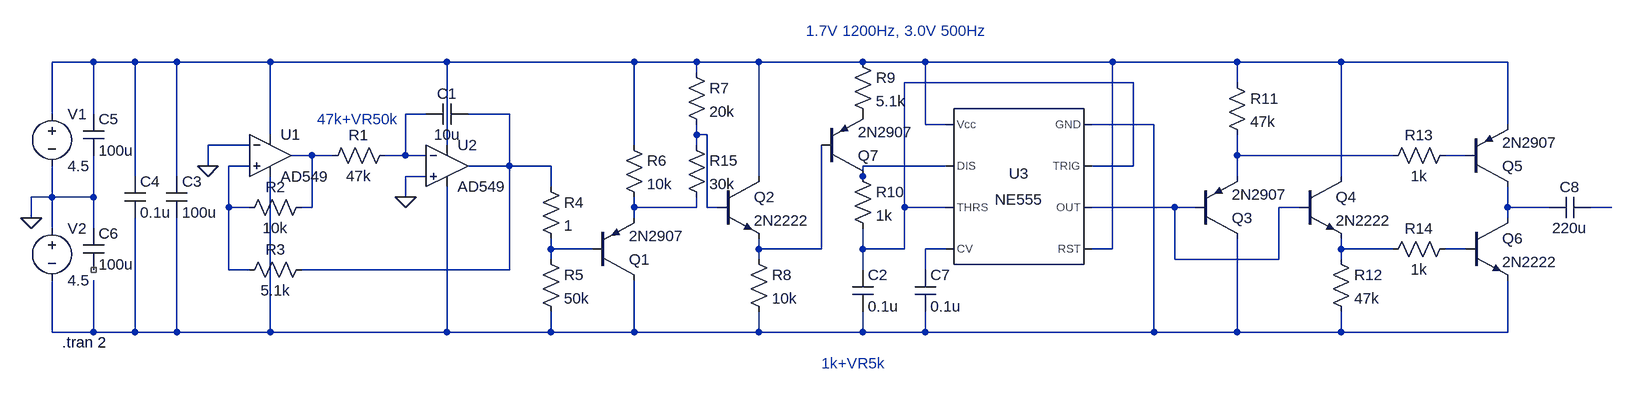
[diagram p0: schematic synthesizer2.asc]
synthesizer2.asc, the LTspice schematic file:
Version 4
SHEET 1 2196 696
WIRE -144 -32 -208 -32
WIRE -80 -32 -144 -32
WIRE -16 -32 -80 -32
WIRE 128 -32 -16 -32
WIRE 400 -32 128 -32
WIRE 688 -32 400 -32
WIRE 784 -32 688 -32
WIRE 880 -32 784 -32
WIRE 1040 -32 880 -32
WIRE 1136 -32 1040 -32
WIRE 1424 -32 1136 -32
WIRE 1616 -32 1424 -32
WIRE 1776 -32 1616 -32
WIRE 2032 -32 1776 -32
WIRE 784 -16 784 -32
WIRE 1456 0 1104 0
WIRE 1616 0 1616 -32
WIRE -208 48 -208 -32
WIRE -144 48 -144 -32
WIRE 368 48 336 48
WIRE 496 48 432 48
WIRE 1136 64 1136 -32
WIRE 1168 64 1136 64
WIRE 1488 64 1392 64
WIRE 2032 64 2032 -32
WIRE 128 80 128 -32
WIRE 784 80 784 64
WIRE 800 80 784 80
WIRE 96 96 32 96
WIRE 400 96 400 -32
WIRE 688 96 688 -32
WIRE 784 96 784 80
WIRE 192 112 160 112
WIRE 224 112 192 112
WIRE 336 112 336 48
WIRE 336 112 304 112
WIRE 368 112 336 112
WIRE 1616 112 1616 80
WIRE 1856 112 1616 112
WIRE 1968 112 1936 112
WIRE 32 128 32 96
WIRE 96 128 64 128
WIRE 496 128 496 48
WIRE 496 128 432 128
WIRE 560 128 496 128
WIRE 1168 128 1040 128
WIRE 1456 128 1456 0
WIRE 1456 128 1392 128
WIRE -80 144 -80 -32
WIRE -16 144 -16 -32
WIRE 368 144 336 144
WIRE 880 144 880 -32
WIRE 1040 144 1040 128
WIRE 1616 144 1616 112
WIRE 1776 144 1776 -32
WIRE 560 160 560 128
WIRE -208 176 -208 128
WIRE -208 176 -240 176
WIRE -144 176 -144 112
WIRE -144 176 -208 176
WIRE 336 176 336 144
WIRE 64 192 64 128
WIRE 96 192 64 192
WIRE 192 192 192 112
WIRE 192 192 176 192
WIRE 688 192 688 176
WIRE 784 192 784 176
WIRE 784 192 688 192
WIRE 800 192 800 80
WIRE 816 192 800 192
WIRE 1104 192 1104 0
WIRE 1168 192 1104 192
WIRE 1520 192 1392 192
WIRE 1552 192 1520 192
WIRE 1712 192 1680 192
WIRE 2032 192 2032 160
WIRE 2096 192 2032 192
WIRE 2192 192 2160 192
WIRE -240 208 -240 176
WIRE 688 208 688 192
WIRE 2032 208 2032 192
WIRE -208 224 -208 176
WIRE -144 224 -144 176
WIRE 560 256 560 240
WIRE 624 256 560 256
WIRE 880 256 880 240
WIRE 976 256 976 96
WIRE 976 256 880 256
WIRE 1040 256 1040 224
WIRE 1104 256 1104 192
WIRE 1104 256 1040 256
WIRE 1168 256 1136 256
WIRE 1424 256 1424 -32
WIRE 1424 256 1392 256
WIRE 1776 256 1776 240
WIRE 1856 256 1776 256
WIRE 1968 256 1936 256
WIRE 560 272 560 256
WIRE 880 272 880 256
WIRE 1520 272 1520 192
WIRE 1680 272 1680 192
WIRE 1680 272 1520 272
WIRE 1776 272 1776 256
WIRE 64 288 64 192
WIRE 96 288 64 288
WIRE 496 288 496 128
WIRE 496 288 176 288
WIRE 1040 288 1040 256
WIRE 1136 288 1136 256
WIRE -208 384 -208 304
WIRE -144 384 -144 304
WIRE -144 384 -208 384
WIRE -80 384 -80 208
WIRE -80 384 -144 384
WIRE -16 384 -16 208
WIRE -16 384 -80 384
WIRE 128 384 128 144
WIRE 128 384 -16 384
WIRE 400 384 400 160
WIRE 400 384 128 384
WIRE 560 384 560 352
WIRE 560 384 400 384
WIRE 688 384 688 304
WIRE 688 384 560 384
WIRE 880 384 880 352
WIRE 880 384 688 384
WIRE 1040 384 1040 352
WIRE 1040 384 880 384
WIRE 1136 384 1136 352
WIRE 1136 384 1040 384
WIRE 1488 384 1488 64
WIRE 1488 384 1136 384
WIRE 1616 384 1616 240
WIRE 1616 384 1488 384
WIRE 1776 384 1776 352
WIRE 1776 384 1616 384
WIRE 2032 384 2032 304
WIRE 2032 384 1776 384
FLAG 32 128 0
FLAG 336 176 0
FLAG -240 208 0
SYMBOL Opamps\\AD549 128 48 R0
SYMATTR InstName U1
SYMBOL Opamps\\AD549 400 64 R0
SYMATTR InstName U2
SYMBOL res 320 96 R90
WINDOW 0 0 56 VBottom 2
WINDOW 3 32 56 VTop 2
SYMATTR InstName R1
SYMATTR Value 47k
SYMBOL res 192 176 R90
WINDOW 0 0 56 VBottom 2
WINDOW 3 32 56 VTop 2
SYMATTR InstName R2
SYMATTR Value 10k
SYMBOL res 192 272 R90
WINDOW 0 0 56 VBottom 2
WINDOW 3 32 56 VTop 2
SYMATTR InstName R3
SYMATTR Value 5.1k
SYMBOL cap 432 32 R90
WINDOW 0 0 32 VBottom 2
WINDOW 3 32 32 VTop 2
SYMATTR InstName C1
SYMATTR Value 10u
SYMBOL voltage -208 32 R0
WINDOW 123 0 0 Left 0
WINDOW 39 0 0 Left 0
SYMATTR InstName V1
SYMATTR Value 4.5
SYMBOL voltage -208 208 R0
WINDOW 123 0 0 Left 0
WINDOW 39 0 0 Left 0
SYMATTR InstName V2
SYMATTR Value 4.5
SYMBOL res 544 144 R0
SYMATTR InstName R4
SYMATTR Value 1
SYMBOL res 544 256 R0
SYMATTR InstName R5
SYMATTR Value 50k
SYMBOL pnp 624 304 M180
SYMATTR InstName Q1
SYMATTR Value 2N2907
SYMBOL res 672 80 R0
SYMATTR InstName R6
SYMATTR Value 10k
SYMBOL res 864 256 R0
SYMATTR InstName R8
SYMATTR Value 10k
SYMBOL npn 816 144 R0
SYMATTR InstName Q2
SYMATTR Value 2N2222
SYMBOL cap -32 144 R0
SYMATTR InstName C3
SYMATTR Value 100u
SYMBOL cap -96 144 R0
SYMATTR InstName C4
SYMATTR Value 0.1u
SYMBOL cap -160 48 R0
SYMATTR InstName C5
SYMATTR Value 100u
SYMBOL cap -160 224 R0
SYMATTR InstName C6
SYMATTR Value 100u
SYMBOL Misc\\NE555 1280 160 M0
SYMATTR InstName U3
SYMBOL cap 1024 288 R0
SYMATTR InstName C2
SYMATTR Value 0.1u
SYMBOL res 1024 -48 R0
SYMATTR InstName R9
SYMATTR Value 5.1k
SYMBOL cap 1120 288 R0
SYMATTR InstName C7
SYMATTR Value 0.1u
SYMBOL pnp 1552 240 M180
SYMATTR InstName Q3
SYMATTR Value 2N2907
SYMBOL res 1600 -16 R0
SYMATTR InstName R11
SYMATTR Value 47k
SYMBOL npn 1712 144 R0
SYMATTR InstName Q4
SYMATTR Value 2N2222
SYMBOL res 1760 256 R0
SYMATTR InstName R12
SYMATTR Value 47k
SYMBOL res 1952 96 R90
WINDOW 0 0 56 VBottom 2
WINDOW 3 32 56 VTop 2
SYMATTR InstName R13
SYMATTR Value 1k
SYMBOL res 1952 240 R90
WINDOW 0 0 56 VBottom 2
WINDOW 3 32 56 VTop 2
SYMATTR InstName R14
SYMATTR Value 1k
SYMBOL pnp 1968 160 M180
SYMATTR InstName Q5
SYMATTR Value 2N2907
SYMBOL npn 1968 208 R0
SYMATTR InstName Q6
SYMATTR Value 2N2222
SYMBOL cap 2160 176 R90
WINDOW 0 0 32 VBottom 2
WINDOW 3 32 32 VTop 2
SYMATTR InstName C8
SYMATTR Value 220u
SYMBOL res 1024 128 R0
SYMATTR InstName R10
SYMATTR Value 1k
SYMBOL pnp 976 144 M180
SYMATTR InstName Q7
SYMATTR Value 2N2907
SYMBOL res 768 -32 R0
SYMATTR InstName R7
SYMATTR Value 20k
SYMBOL res 768 80 R0
SYMATTR InstName R15
SYMATTR Value 30k
TEXT -192 400 Left 2 !.tran 2
TEXT 200 56 Left 2 ;47k+VR50k
TEXT 952 -80 Left 2 ;1.7V 1200Hz, 3.0V 500Hz
TEXT 976 432 Left 2 ;1k+VR5k

The netlist it stands for:
* synthesizer2.asc
XU1 N010 0 N001 N005 N007 AD549  ; pins In+ In- V+ V- OUT
XU2 0 N003 N001 N005 N004 AD549  ; pins In+ In- V+ V- OUT
R1 N003 N007 47k
R2 N007 N010 10k
R3 N004 N010 5.1k
C1 N004 N003 10u
V1 N001 0 4.5
V2 0 N005 4.5
R4 N004 N016 1
R5 N016 N005 50k
Q1 N005 N016 N012 0 2N2907
R6 N001 N012 10k
R8 N017 N005 10k
Q2 N001 N006 N017 0 2N2222
C3 N001 N005 100u
C4 N001 N005 0.1u
C5 N001 0 100u
C6 0 NC_01 100u
XU3 N005 N002 N013 N001 N018 N002 N011 N001 NE555  ; pins GND TRIG OUT RST CV THRS DIS Vcc
C2 N002 N005 0.1u
R9 N001 P001 5.1k
C7 N018 N005 0.1u
Q3 N005 N013 N008 0 2N2907
R11 N001 N008 47k
Q4 N001 N013 N019 0 2N2222
R12 N019 N005 47k
R13 N009 N008 1k
R14 N020 N019 1k
Q5 N014 N009 N001 0 2N2907
Q6 N014 N020 N005 0 2N2222
C8 N015 N014 220u
R10 N011 N002 1k
Q7 N011 N017 P001 0 2N2907
R7 N001 N006 20k
R15 N006 N012 30k
.model NPN NPN
.model PNP PNP
.lib standard.bjt
.tran 2
* 47k+VR50k
* 1.7V 1200Hz, 3.0V 500Hz
* 1k+VR5k
.lib NE555.sub
.backanno
.end